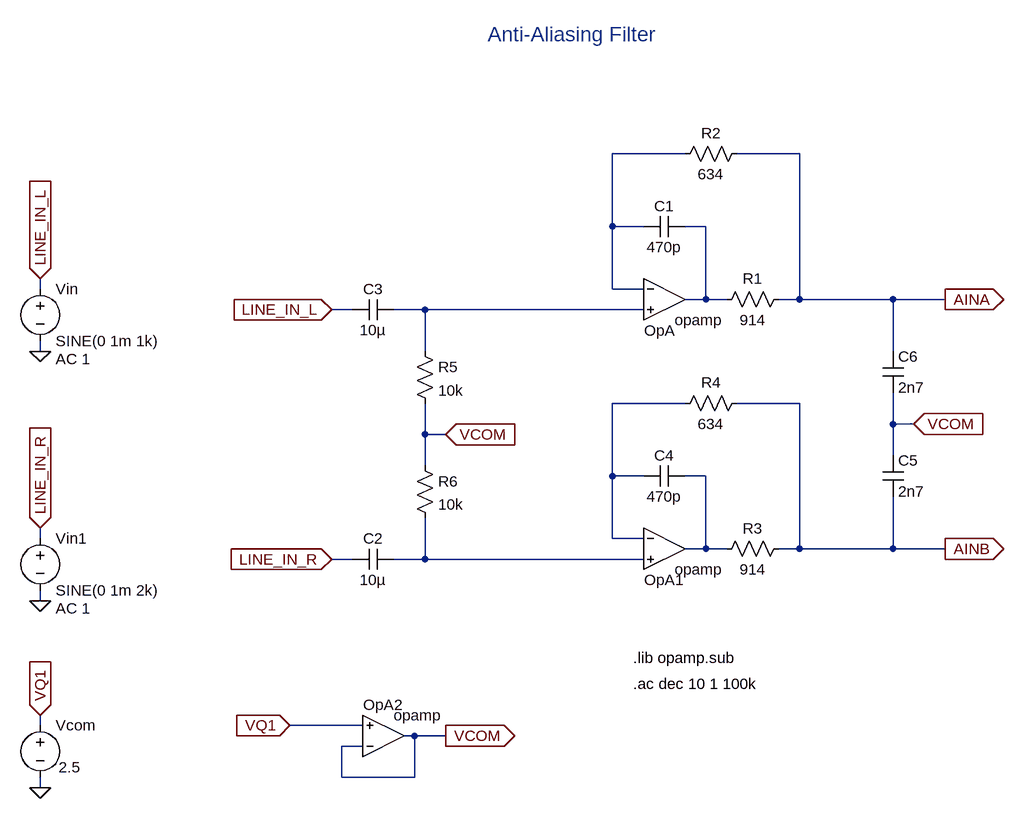
[diagram p0: schematic anti_aliasing_filter.asc]
anti_aliasing_filter.asc, the LTspice schematic file:
Version 4
SHEET 1 944 680
WIRE 416 -336 304 -336
WIRE 592 -336 496 -336
WIRE 304 -224 304 -336
WIRE 352 -224 304 -224
WIRE 448 -224 416 -224
WIRE -576 -128 -576 -144
WIRE 304 -128 304 -224
WIRE 352 -128 304 -128
WIRE 448 -112 448 -224
WIRE 448 -112 416 -112
WIRE 480 -112 448 -112
WIRE 592 -112 592 -336
WIRE 592 -112 560 -112
WIRE 736 -112 592 -112
WIRE 816 -112 736 -112
WIRE -96 -96 -128 -96
WIRE 16 -96 -32 -96
WIRE 352 -96 16 -96
WIRE -576 -32 -576 -48
WIRE 16 -32 16 -96
WIRE 736 -32 736 -112
WIRE 416 48 304 48
WIRE 592 48 496 48
WIRE 736 80 736 32
WIRE 768 80 736 80
WIRE 16 96 16 48
WIRE 48 96 16 96
WIRE 736 128 736 80
WIRE 16 144 16 96
WIRE 304 160 304 48
WIRE 352 160 304 160
WIRE 448 160 416 160
WIRE -576 256 -576 240
WIRE 304 256 304 160
WIRE 352 256 304 256
WIRE 448 272 448 160
WIRE 448 272 416 272
WIRE 480 272 448 272
WIRE 592 272 592 48
WIRE 592 272 560 272
WIRE 736 272 736 192
WIRE 736 272 592 272
WIRE 816 272 736 272
WIRE -96 288 -128 288
WIRE 16 288 16 224
WIRE 16 288 -32 288
WIRE 352 288 16 288
WIRE -576 352 -576 336
WIRE -576 544 -576 528
WIRE -80 544 -192 544
WIRE 0 560 -16 560
WIRE 48 560 0 560
WIRE -80 576 -112 576
WIRE -112 624 -112 576
WIRE 0 624 0 560
WIRE 0 624 -112 624
WIRE -576 640 -576 624
FLAG -576 -32 0
FLAG -576 -144 LINE_IN_L
IOPIN -576 -144 In
FLAG -128 -96 LINE_IN_L
IOPIN -128 -96 In
FLAG 816 -112 AINA
IOPIN 816 -112 Out
FLAG 48 560 VCOM
IOPIN 48 560 Out
FLAG -128 288 LINE_IN_R
IOPIN -128 288 In
FLAG 816 272 AINB
IOPIN 816 272 Out
FLAG -192 544 VQ1
IOPIN -192 544 In
FLAG 48 96 VCOM
IOPIN 48 96 In
FLAG -576 640 0
FLAG -576 528 VQ1
IOPIN -576 528 In
FLAG -576 352 0
FLAG -576 240 LINE_IN_R
IOPIN -576 240 In
FLAG 768 80 VCOM
IOPIN 768 80 In
SYMBOL OpAmps\\opamp 384 -176 R0
WINDOW 0 -31 112 Left 2
SYMATTR InstName OpA
SYMBOL voltage -576 -144 R0
WINDOW 123 24 124 Left 2
WINDOW 39 0 0 Left 0
SYMATTR Value2 AC 1
SYMATTR InstName Vin
SYMATTR Value SINE(0 1m 1k)
SYMBOL cap -32 -112 R90
WINDOW 0 0 32 VBottom 2
WINDOW 3 32 32 VTop 2
SYMATTR InstName C3
SYMATTR Value 10µ
SYMBOL cap 416 -240 R90
WINDOW 0 0 32 VBottom 2
WINDOW 3 32 32 VTop 2
SYMATTR InstName C1
SYMATTR Value 470p
SYMBOL res 576 -128 R90
WINDOW 0 0 56 VBottom 2
WINDOW 3 32 56 VTop 2
SYMATTR InstName R1
SYMATTR Value 914
SYMBOL res 512 -352 R90
WINDOW 0 0 56 VBottom 2
WINDOW 3 32 56 VTop 2
SYMATTR InstName R2
SYMATTR Value 634
SYMBOL OpAmps\\opamp 384 208 R0
WINDOW 0 -31 112 Left 2
SYMATTR InstName OpA1
SYMBOL cap -32 272 R90
WINDOW 0 0 32 VBottom 2
WINDOW 3 32 32 VTop 2
SYMATTR InstName C2
SYMATTR Value 10µ
SYMBOL cap 416 144 R90
WINDOW 0 0 32 VBottom 2
WINDOW 3 32 32 VTop 2
SYMATTR InstName C4
SYMATTR Value 470p
SYMBOL res 576 256 R90
WINDOW 0 0 56 VBottom 2
WINDOW 3 32 56 VTop 2
SYMATTR InstName R3
SYMATTR Value 914
SYMBOL res 512 32 R90
WINDOW 0 0 56 VBottom 2
WINDOW 3 32 56 VTop 2
SYMATTR InstName R4
SYMATTR Value 634
SYMBOL res 0 -48 R0
SYMATTR InstName R5
SYMATTR Value 10k
SYMBOL res 0 128 R0
SYMATTR InstName R6
SYMATTR Value 10k
SYMBOL cap 720 -32 R0
SYMATTR InstName C6
SYMATTR Value 2n7
SYMBOL OpAmps\\opamp -48 624 M180
WINDOW 0 -31 112 Left 2
SYMATTR InstName OpA2
SYMBOL voltage -576 528 R0
WINDOW 123 24 124 Left 2
WINDOW 39 0 0 Left 0
WINDOW 3 28 80 Left 2
SYMATTR Value 2.5
SYMATTR InstName Vcom
SYMBOL voltage -576 240 R0
WINDOW 123 24 124 Left 2
WINDOW 39 0 0 Left 0
SYMATTR Value2 AC 1
SYMATTR InstName Vin1
SYMATTR Value SINE(0 1m 2k)
SYMBOL cap 720 128 R0
SYMATTR InstName C5
SYMATTR Value 2n7
TEXT 336 440 Left 2 !.lib opamp.sub
TEXT 336 480 Left 2 !.ac dec 10 1 100k
TEXT 112 -520 Left 3 ;Anti-Aliasing Filter

The netlist it stands for:
* anti_aliasing_filter.asc
XOpA N001 N003 N002 opamp Aol=100K GBW=10Meg  ; pins invin noninvin out
Vin LINE_IN_L 0 SINE(0 1m 1k) AC 1
C3 N003 LINE_IN_L 10µ
C1 N002 N001 470p
R1 AINA N002 914
R2 AINA N001 634
XOpA1 N004 N006 N005 opamp Aol=100K GBW=10Meg  ; pins invin noninvin out
C2 N006 LINE_IN_R 10µ
C4 N005 N004 470p
R3 AINB N005 914
R4 AINB N004 634
R5 N003 VCOM 10k
R6 VCOM N006 10k
C6 AINA VCOM 2n7
XOpA2 VCOM VQ1 VCOM opamp Aol=100K GBW=10Meg  ; pins invin noninvin out
Vcom VQ1 0 2.5
Vin1 LINE_IN_R 0 SINE(0 1m 2k) AC 1
C5 VCOM AINB 2n7
.lib opamp.sub
.ac dec 10 1 100k
* Anti-Aliasing Filter
.backanno
.end